# Altium schematic sheet IO_Expandor.SchDoc
size A4; Revision: C.2(PCB.SCH)
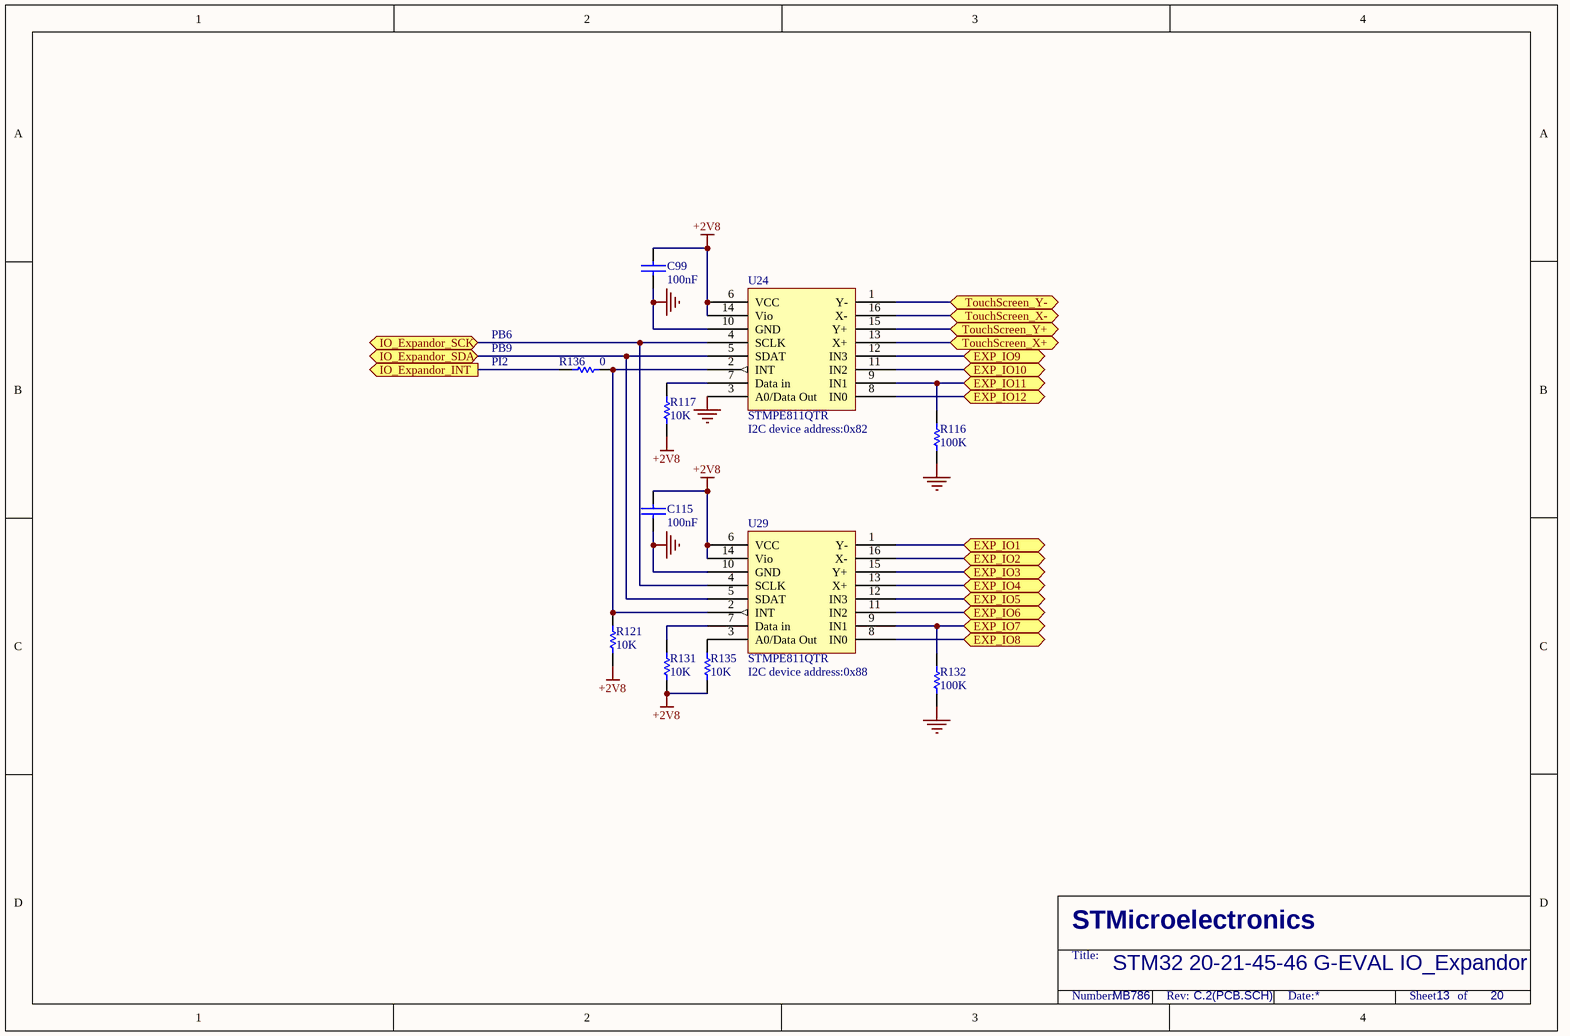
[diagram p0: IO_Expandor.SchDoc]

## Parts
C99  100nF  [0402C]
C115  100nF  [0402C]
R116  100K  [0402R]
R117  10K  [0402R]
R121  10K  [0402R]
R131  10K  [0402R]
R132  100K  [0402R]
R135  10K  [0402R]
R136  0  [0603R]
U24  STMPE811QTR  [QFN16(3X3)]
U29  STMPE811QTR  [QFN16(3X3)]

## Ports
EXP_IO1 (bidir), EXP_IO2 (bidir), EXP_IO3 (bidir), EXP_IO4 (bidir), EXP_IO5 (bidir), EXP_IO6 (bidir), EXP_IO7 (bidir), EXP_IO8 (bidir), EXP_IO9 (bidir), EXP_IO10 (bidir), EXP_IO11 (bidir), EXP_IO12 (bidir), IO_Expandor_INT (out), IO_Expandor_SCK (bidir), IO_Expandor_SDA (bidir), TouchScreen_X+ (bidir), TouchScreen_X- (bidir), TouchScreen_Y+ (bidir), TouchScreen_Y- (bidir)

## Nets
+2V8: C99.1 C115.2 R117.2 R121.2 R131.2 R135.2 U24.6(VCC) U24.14(Vio) U29.6(VCC) U29.14(Vio)
GND: C99.2 C115.1 R116.2 R132.2 U24.3(A0/Data_Out) U24.10(GND) U29.10(GND)
EXP_IO1: U29.1(Y-) ; port EXP_IO1
EXP_IO2: U29.16(X-) ; port EXP_IO2
EXP_IO3: U29.15(Y+) ; port EXP_IO3
EXP_IO4: U29.13(X+) ; port EXP_IO4
EXP_IO5: U29.12(IN3) ; port EXP_IO5
EXP_IO6: U29.11(IN2) ; port EXP_IO6
EXP_IO7: R132.1 U29.9(IN1) ; port EXP_IO7
EXP_IO8: U29.8(IN0) ; port EXP_IO8
EXP_IO9: U24.12(IN3) ; port EXP_IO9
EXP_IO10: U24.11(IN2) ; port EXP_IO10
EXP_IO11: R116.1 U24.9(IN1) ; port EXP_IO11
EXP_IO12: U24.8(IN0) ; port EXP_IO12
IO_Expandor_INT: R136.1 ; port IO_Expandor_INT
IO_Expandor_SCK: U24.4(SCLK) U29.4(SCLK) ; port IO_Expandor_SCK
IO_Expandor_SDA: U24.5(SDAT) U29.5(SDAT) ; port IO_Expandor_SDA
TouchScreen_X+: U24.13(X+) ; port TouchScreen_X+
TouchScreen_X-: U24.16(X-) ; port TouchScreen_X-
TouchScreen_Y+: U24.15(Y+) ; port TouchScreen_Y+
TouchScreen_Y-: U24.1(Y-) ; port TouchScreen_Y-
NetR117_1: R117.1 U24.7(Data_in)
NetR121_1: R121.1 R136.2 U24.2(INT) U29.2(INT)
NetR131_1: R131.1 U29.7(Data_in)
NetR135_1: R135.1 U29.3(A0/Data_Out)

## Notes on the sheet
- PB9
- PB6
- PI2
- (near U24) I2C device address:0x82
- I2C device address:0x88
- STM32 20-21-45-46 G-EVAL IO_Expandor
- MB786
- 13
- 20
- STMicroelectronics
- Title:
- Number:
- Rev:
- Date:
- Sheet       of

## Library data of the parts
C99 C115 = CAP: Capacitor
R116 R117 R121 R131 R132 R135 R136 = Res1: Resistor; Value: 1K; Published: 8-Jun-2000; Revision: July-2002: Re-released for DXP Platform.; Publisher: Altium Limited
U24 U29 = STMPE811